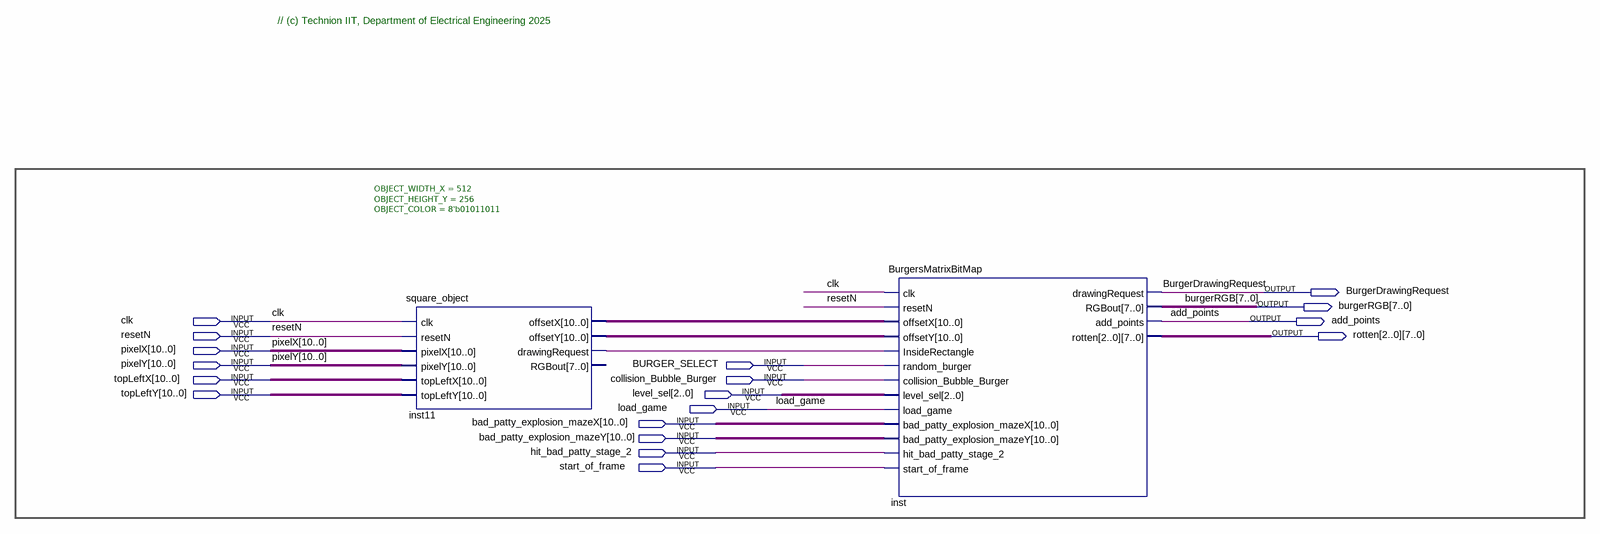
[diagram p0: schematic sheet]
// Quartus schematic BURGER_DISPLAY.bdf as structural Verilog: 2 symbols, 18 pins
module BURGER_DISPLAY (
  input  clk,
  input  resetN,
  input  [10:0] pixelX,
  input  [10:0] pixelY,
  input  BURGER_SELECT,
  input  [10:0] topLeftX,
  input  collision_Bubble_Burger,
  input  [10:0] topLeftY,
  input  [2:0] level_sel,
  input  load_game,
  input  [10:0] bad_patty_explosion_mazeX,
  input  [10:0] bad_patty_explosion_mazeY,
  input  hit_bad_patty_stage_2,
  input  start_of_frame,
  output BurgerDrawingRequest,
  output [7:0] burgerRGB,
  output add_points,
  output [7:0] rotten_2,
  output [7:0] rotten_1,
  output [7:0] rotten_0
);

  wire inst11_drawingrequest;
  wire [10:0] inst11_offsetx, inst11_offsety;

  square_object #(.OBJECT_WIDTH_X(512), .OBJECT_HEIGHT_Y(256), .OBJECT_COLOR(8'b01011011)) inst11 (
    .clk(clk), .resetN(resetN), .pixelX(pixelX), .pixelY(pixelY), .topLeftX(topLeftX), .topLeftY(topLeftY),
    .offsetX(inst11_offsetx), .offsetY(inst11_offsety), .drawingRequest(inst11_drawingrequest));  // open: RGBout
  BurgersMatrixBitMap inst (
    .clk(clk), .resetN(resetN), .offsetX(inst11_offsetx), .offsetY(inst11_offsety),
    .InsideRectangle(inst11_drawingrequest), .random_burger(BURGER_SELECT),
    .collision_Bubble_Burger(collision_Bubble_Burger), .level_sel(level_sel), .load_game(load_game),
    .bad_patty_explosion_mazeX(bad_patty_explosion_mazeX),
    .bad_patty_explosion_mazeY(bad_patty_explosion_mazeY), .hit_bad_patty_stage_2(hit_bad_patty_stage_2),
    .start_of_frame(start_of_frame), .drawingRequest(BurgerDrawingRequest), .RGBout(burgerRGB),
    .add_points(add_points), .rotten({rotten_2, rotten_1, rotten_0}));

  // Notes on the sheet:
  //   // (c) Technion IIT, Department of Electrical Engineering 2025
endmodule
